# EAGLE design as5035 (EAGLE 5.11)
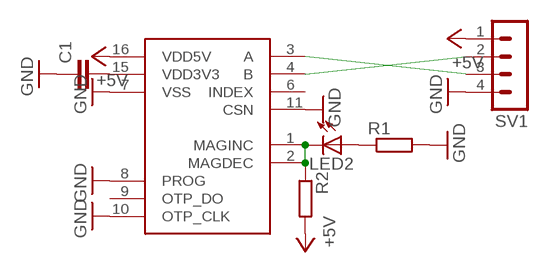
[diagram p0: schematic, sheet 1]

## Parts
C1  C-EUC0805  [C0805]
LED2  LEDCHIPLED_1206  [CHIPLED_1206]
R1  R-EU_R0805  [R0805]
R2  R-EU_R0805  [R0805]
SV1  MA04-1  [MA04-1]
U$1  AS5035  [SSOP16]

## Nets
+5V: R2.2 SV1.1 U$1.16(VDD5V)
GND: C1.1 R1.2 SV1.4 U$1.7(VSS) U$1.8(PROG) U$1.10(OTP_CLK) U$1.11(CSN)
N$1: C1.2 U$1.15(VDD3V3)
N$2: LED2.C R2.1 U$1.1(MAGINC) U$1.2(MAGDEC)
N$3: LED2.A R1.1
N$4: SV1.2 U$1.4(B)
N$5: SV1.3 U$1.3(A)
Unconnected: U$1.6(INDEX) U$1.9(OTP_DO)

## Library data of the parts
C1 = resistor:C-EU: CAPACITOR, European symbol
LED2 = led:LED: LED OSRAM: - CHIPLED LG R971, LG N971, LY N971, LG Q971, LY Q971, LO R971, LY R971 LH N974, LH R974 LS Q976, LO Q976, LY Q976 LO Q996 - Hyper CHIPLED LW Q18S LB Q993, LB Q99A, LB R99A - SideLED LS A670, LO A670, LY A670, LG A670, LP A670 LB A673, LV A673, LT A673, LW A673 LH A674 LY A675 LS A676, LA A676, LO A676, LY A676, LW A676 LS A679, LY A679, LG A679 - Hyper Micro SIDELED® LS Y876, LA Y876, LO Y876, LY Y876 LT Y87S - SmartLED LW L88C, LW L88S LB L89C, LB L89S, LG L890 LS L89K, LO L89K, LY L89K LS L896, LA L896, LO L896, LY L896 - TOPLED LS T670, LO T670, LY T670, LG T670, LP T670 LSG T670, LSP T670, LSY T670, LOP T670, LYG T670 LG T671, LOG T671, LSG T671 LB T673, LV T673, LT T673, LW T673 LH T674 LS T676, LA T676, LO T676, LY T676, LB T676, LH T676, LSB T676, LW T676 LB T67C, LV T67C, LT T67C, LS T67K, LO T67K, LY T67K, LW E67C LS E67B, LA E67B, LO E67B, LY E67B, LB E67C, LV E67C, LT E67C LW T67C LS T679, LY T679, LG T679 LS T770, LO T770, LY T770, LG T770, LP T770 LB T773, LV T773, LT T773, LW T773 LH T774 LS E675, LA E675, LY E675, LS T675 LS T776, LA T776, LO T776, LY T776, LB T776 LHGB T686 LT T68C, LB T68C - Hyper Mini TOPLED® LB M676 - Mini TOPLED Santana® LG M470 LS M47K, LO M47K, LY M47K Source: http://www.osram.convergy.de LUXEON: - LUMILED® LXK2-PW12-R00, LXK2-PW12-S00, LXK2-PW14-U00, LXK2-PW14-V00 LXK2-PM12-R00, LXK2-PM12-S00, LXK2-PM14-U00 LXK2-PE12-Q00, LXK2-PE12-R00, LXK2-PE12-S00, LXK2-PE14-T00, LXK2-PE14-U00 LXK2-PB12-K00, LXK2-PB12-L00, LXK2-PB12-M00, LXK2-PB14-N00, LXK2-PB14-P00, LXK2-PB14-Q00 LXK2-PR12-L00, LXK2-PR12-M00, LXK2-PR14-Q00, LXK2-PR14-R00 LXK2-PD12-Q00, LXK2-PD12-R00, LXK2-PD12-S00 LXK2-PH12-R00, LXK2-PH12-S00 LXK2-PL12-P00, LXK2-PL12-Q00, LXK2-PL12-R00 Source: www.luxeon.com KINGBRIGHT: KA-3528ASYC Source: www.kingbright.com
R1 R2 = resistor:R-EU_: RESISTOR, European symbol
SV1 = con-lstb:MA04-1: PIN HEADER; OC_FARNELL: unknown; OC_NEWARK: unknown
U$1 = as5035:AS5035

## Board
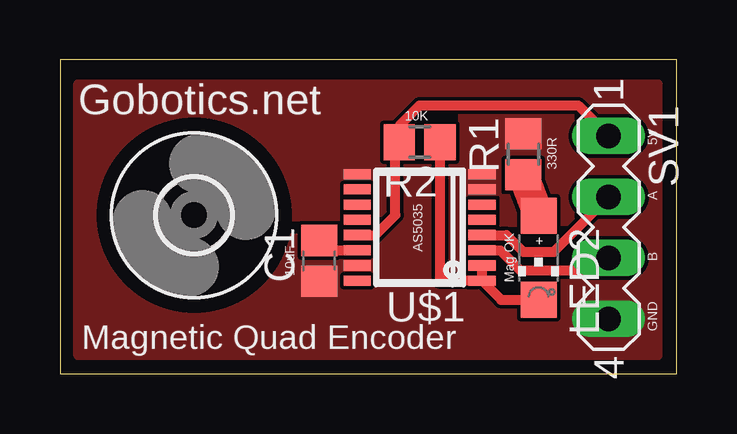
[diagram p1: board, top side]

Size 25.7 x 13.07 mm. Coordinates in mm from the lower left corner, seen from the top.
Outline: 0,0 25.7,0 25.7,13.07 0,13.07 0,0
Copper layers (1*16): Top 0.035mm / dielectric 1.5mm / Bottom 0.035mm
Design rules "Fusion_eagle_rule_v1.1": minimum track width 6mil, minimum drill 12mil, track to track 6mil, track to pad 6mil, pad to pad 6mil, via to via 6mil, smd to smd 0mil, copper to edge 10mil, drill to drill 10mil, minimum pad ring 10mil, minimum via ring 6mil, stop-mask expansion 2mil, vias tented up to drill 100mil, thermal gap 10mil

### Footprints (pad centres in the part's own frame; a part is rotated, then mirrored left to right if it is on the bottom)
C0805 = smd 1.3 x 1.5: 1 -0.85,0; 2 0.85,0
CHIPLED_1206 = smd 1.5 x 1.5: A 0,-1.75; C 0,1.75
R0805 = smd 1.3 x 1.5: 1 -0.85,0; 2 0.85,0
MA04-1 = drill 1.016 long: 1 -3.81,0; 2 -1.27,0; 3 1.27,0; 4 3.81,0
SSOP16 = smd 0.419 x 1.143: 1 -2.223,-2.6; 2 -1.587,-2.6; 3 -0.953,-2.6; 4 -0.318,-2.6; 5 0.318,-2.6; 6 0.953,-2.6; 7 1.587,-2.6; 8 2.223,-2.6; 9 1.587,2.6; 10 -1.587,2.6; 11 2.223,2.6; 12 0.953,2.6; 13 0.318,2.6; 14 -2.223,2.6; 15 -0.953,2.6; 16 -0.318,2.6
3,0 = hole 3: 0,0

### Placement (x,y rotation side)
C1  10.79,4.7 90 top
LED2  19.94,4.83 180 top
R1  19.3,9.14 90 top
R2  14.99,9.65 180 top
SV1  22.86,6.1 270 top
U$1  14.99,6.1 90 top
U$2  [3,0]  5.59,6.6 0 top

### Tracks (layer width: path | path; a pad name or v marks a point on that pad's centre or on a via)
+5V
  Top 0.406: U$1.16 13.14,5.78 13.97,6.6 13.97,9.49 R2.2 14.14,10.33 14.99,11.18 21.59,11.18 SV1.1
GND
  pour Top (no thermals): 0.76,12.06 24.89,12.06 24.89,0.76 0.76,0.76
N$1
  Top 0.406: C1.2 10.82,5.14 U$1.15
N$2
  Top 0.406: U$1.1 U$1.2 | LED2.C 18.38,3.08 U$1.1 | R2.1 15.84,3.87 U$1.1
N$3
  Top 1.27: LED2.A R1.1
N$4
  Top 0.406: U$1.4 18.61,5.78 19.3,5.08 20.57,5.08 SV1.2
N$5
  Top 0.406: U$1.3 18.35,5.14 19.18,4.32 22.35,4.32 SV1.3

### Text on the board
tsilk: Gobotics.net | 10K | 5V | 330R | A | AS5035 | + | 10uF | Mag OK | B | GND | Magnetic Quad Encoder
bsilk: Gobotics.net | Magnetic Quad Encoder | 5V | A | B | GND | (c) 2011 Bob Clough